# Altium schematic sheet pedala axial 03.SchDoc: Digital Guita Pedal
size A4; DrawnBy: Cenusa Mihai Marian; Engineer: Cenusa Mihai Marian; Organization: USV; Revision: v3; SheetNumber: 1; SheetTotal: 1; ProjectName: Digital Guitar Pedal
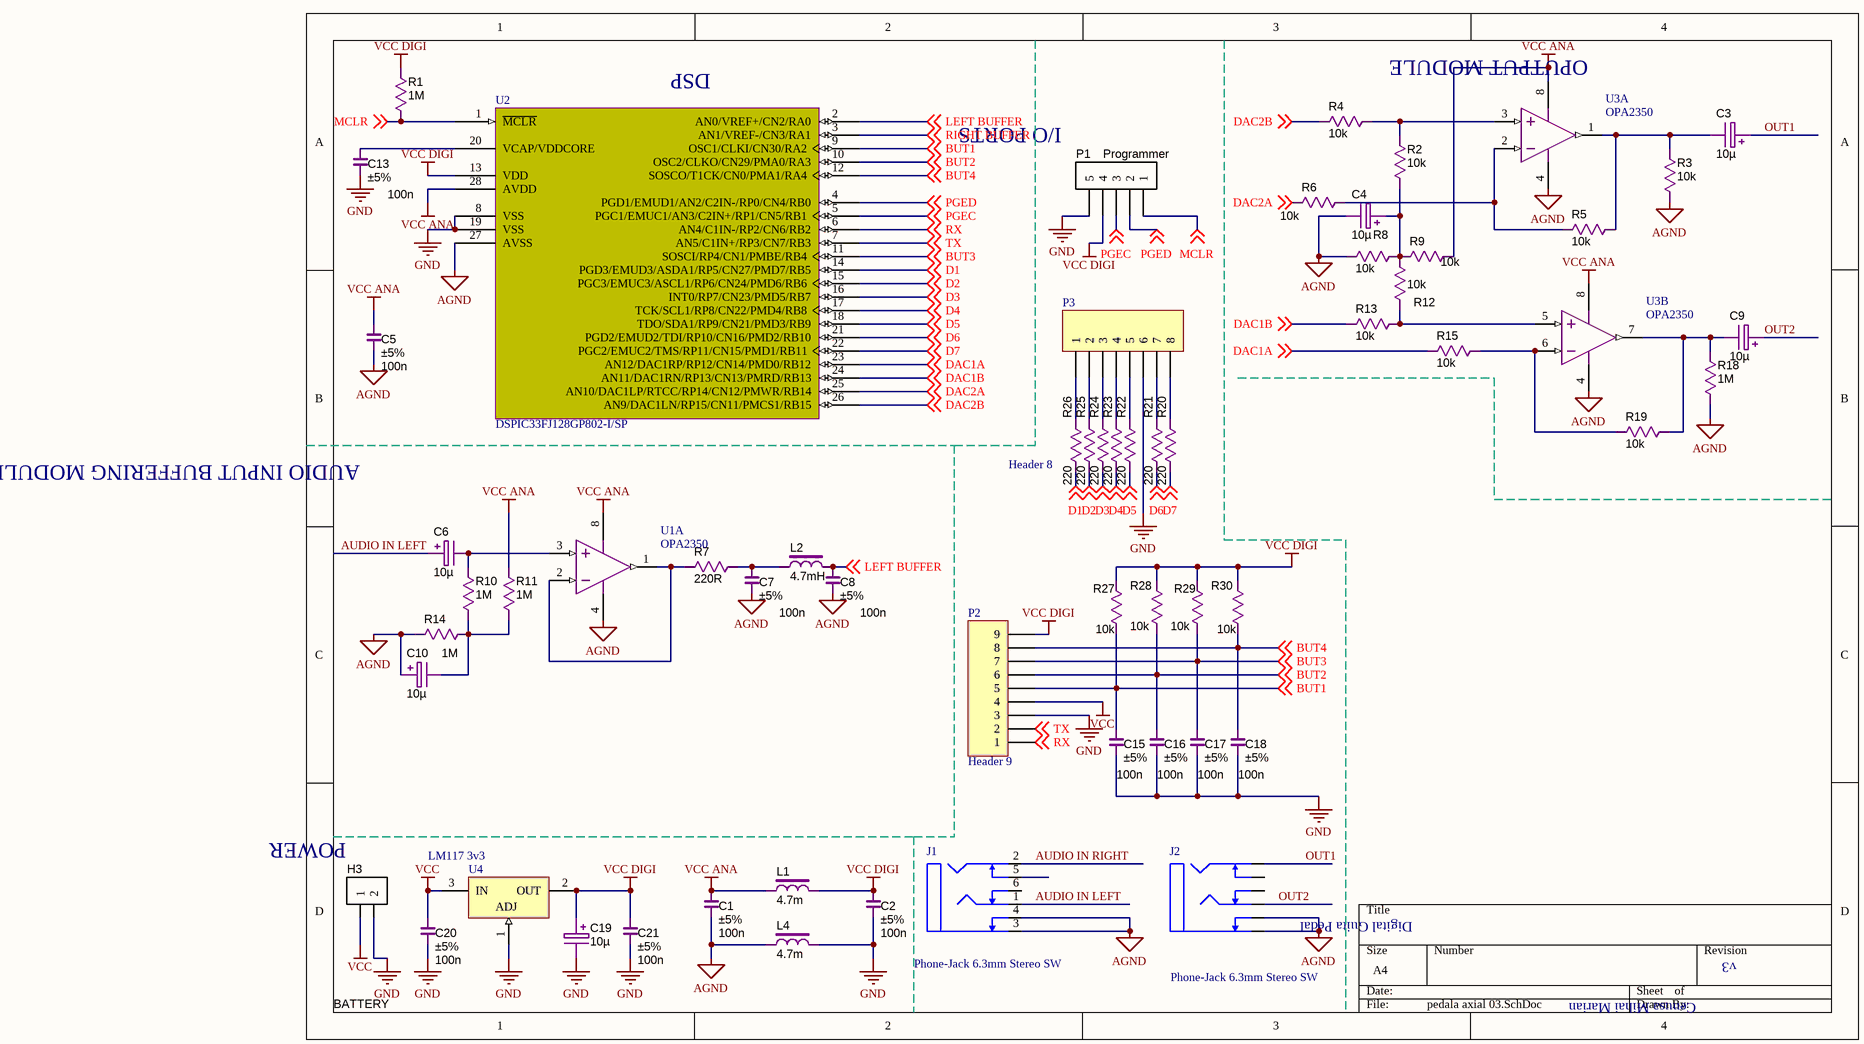
[diagram p0: pedala axial 03.SchDoc]

## Parts
C1  Tolerance: ±5%  [Cap-Disk-D5.5-R2.54]  (hidden comment: 100n)
C2  Tolerance: ±5%  [Cap-Disk-D5.5-R2.54]  (hidden comment: 100n)
C3  10µ  [CAPAE250P680X1220_VERT]
C4  10µ  [CAPAE250P680X1220_VERT]
C5  Tolerance: ±5%  [Cap-Disk-D5.5-R2.54]  (hidden comment: 100n)
C6  10µ  [CAPAE250P680X1220_VERT]
C7  Tolerance: ±5%  [Cap-Disk-D5.5-R2.54]  (hidden comment: 100n)
C8  Tolerance: ±5%  [Cap-Disk-D5.5-R2.54]  (hidden comment: 100n)
C9  10µ  [CAPAE250P680X1220_VERT]
C10  10µ  [CAPAE250P680X1220_VERT]
C13  Tolerance: ±5%  [Cap-Disk-D5.5-R2.54]  (hidden comment: 100n)
C15  Tolerance: ±5%  [Cap-Disk-D5.5-R2.54]  (hidden comment: 100n)
C16  Tolerance: ±5%  [Cap-Disk-D5.5-R2.54]  (hidden comment: 100n)
C17  Tolerance: ±5%  [Cap-Disk-D5.5-R2.54]  (hidden comment: 100n)
C18  Tolerance: ±5%  [Cap-Disk-D5.5-R2.54]  (hidden comment: 100n)
C19  10µ  [R1206-1%]
C20  Tolerance: ±5%  [Cap-Disk-D5.5-R2.54]  (hidden comment: 100n)
C21  Tolerance: ±5%  [Cap-Disk-D5.5-R2.54]  (hidden comment: 100n)
H3  BATTERY  [HDR_1X2X276]  (no BOM)
J1  Phone-Jack 6.3mm Stereo SW  [Phone-Jack Stereo SW 6.3mm]
J2  Phone-Jack 6.3mm Stereo SW  [Phone-Jack Stereo SW 6.3mm]
L1  value 4.7m  [Dr-CW8A]  (hidden comment: INDC_180u_Toroid)
L2  value 4.7mH  [Dr-CW8A]  (hidden comment: INDC_180u_Toroid)
L4  value 4.7m  [Dr-CW8A]  (hidden comment: INDC_180u_Toroid)
P1  Programmer  [HDR1X5_2.54MMP]  (no BOM)
P2  Header 9  [HDR1X9]
P3  Header 8  [HDR1X8]
R1  value 1M  [R0.25-300]  (hidden comment: Thick Film)
R2  value 10k  [R0.25-300]  (hidden comment: Thick Film)
R3  value 10k  [R0.25-300]  (hidden comment: Thick Film)
R4  value 10k  [R0.25-300]  (hidden comment: Thick Film)
R5  value 10k  [R0.25-300]  (hidden comment: Thick Film)
R6  value 10k  [R0.25-300]  (hidden comment: Thick Film)
R7  value 220R  [R0.25-300]  (hidden comment: Thick Film)
R8  value 10k  [R0.25-300]  (hidden comment: Thick Film)
R9  value 10k  [R0.25-300]  (hidden comment: Thick Film)
R10  value 1M  [R0.25-300]  (hidden comment: Thick Film)
R11  value 1M  [R0.25-300]  (hidden comment: Thick Film)
R12  value 10k  [R0.25-300]  (hidden comment: Thick Film)
R13  value 10k  [R0.25-300]  (hidden comment: Thick Film)
R14  value 1M  [R0.25-300]  (hidden comment: Thick Film)
R15  value 10k  [R0.25-300]  (hidden comment: Thick Film)
R18  value 1M  [R0.25-300]  (hidden comment: Thick Film)
R19  value 10k  [R0.25-300]  (hidden comment: Thick Film)
R20  value 220  [R0.25-300]  (hidden comment: Thick Film)
R21  value 220  [R0.25-300]  (hidden comment: Thick Film)
R22  value 220  [R0.25-300]  (hidden comment: Thick Film)
R23  value 220  [R0.25-300]  (hidden comment: Thick Film)
R24  value 220  [R0.25-300]  (hidden comment: Thick Film)
R25  value 220  [R0.25-300]  (hidden comment: Thick Film)
R26  value 220  [R0.25-300]  (hidden comment: Thick Film)
R27  value 10k  [R0.25-300]  (hidden comment: Thick Film)
R28  value 10k  [R0.25-300]  (hidden comment: Thick Film)
R29  value 10k  [R0.25-300]  (hidden comment: Thick Film)
R30  value 10k  [R0.25-300]  (hidden comment: Thick Film)
U1  OPA2350  [DIL8-300a]  (part A of 2)
U2  DSPIC33FJ128GP802-I/SP  [DIP28-300]
U3  OPA2350  [DIL8-300a]  (parts A,B of 2)
U4  LM117 3v3  [TO220-RB-650]

## Nets
AGND: C1.1 C4.2 C5.1 C7.1 C8.1 C10.1 J1.3(G) J1.4(Ga) J2.3(G) J2.4(Ga) L4.1 R3.2 R8.2 R14.2 R18.2 U1.4(V-) U2.27(AVSS) U3.4(V-)
GND: C2.1 C13.1 C15.1 C16.1 C17.1 C18.1 C19.2 C20.1 C21.1 H3.2 L4.2 P1.5 P2.3 P3.6 U2.8(VSS) U2.19(VSS) U4.1(GND)
VCC: C20.2 H3.1 P2.4 U4.3(IN)
VCC ANA: C1.2 C5.2 L1.1 R9.1 R11.1 U1.8(V+) U2.28(AVDD) U3.8(V+)
VCC DIGI: C2.2 C19.1 C21.2 L1.2 P1.4 P2.9 R1.2 R27.2 R28.2 R29.2 R30.2 U2.13(VDD) U4.2(OUT)
AUDIO IN LEFT: C6.1 J1.1(R)
AUDIO IN RIGHT: J1.2(L)
BUT1: C15.2 P2.5 R27.1 U2.9(OSC1/CLKI/CN30/RA2) ; off-sheet BUT1
BUT2: C16.2 P2.6 R28.1 U2.10(OSC2/CLKO/CN29/PMA0/RA3) ; off-sheet BUT2
BUT3: C17.2 P2.7 R29.1 U2.11(SOSCI/RP4/CN1/PMBE/RB4) ; off-sheet BUT3
BUT4: C18.2 P2.8 R30.1 U2.12(SOSCO/T1CK/CN0/PMA1/RA4) ; off-sheet BUT4
D1: R26.1 U2.14(PGD3/EMUD3/ASDA1/RP5/CN27/PMD7/RB5) ; off-sheet D1
D2: R25.1 U2.15(PGC3/EMUC3/ASCL1/RP6/CN24/PMD6/RB6) ; off-sheet D2
D3: R24.1 U2.16(INT0/RP7/CN23/PMD5/RB7) ; off-sheet D3
D4: R23.1 U2.17(TCK/SCL1/RP8/CN22/PMD4/RB8) ; off-sheet D4
D5: R22.1 U2.18(TDO/SDA1/RP9/CN21/PMD3/RB9) ; off-sheet D5
D6: R21.1 U2.21(PGD2/EMUD2/TDI/RP10/CN16/PMD2/RB10) ; off-sheet D6
D7: R20.1 U2.22(PGC2/EMUC2/TMS/RP11/CN15/PMD1/RB11) ; off-sheet D7
DAC1A: R15.1 U2.23(AN12/DAC1RP/RP12/CN14/PMD0/RB12) ; off-sheet DAC1A
DAC1B: R13.1 U2.24(AN11/DAC1RN/RP13/CN13/PMRD/RB13) ; off-sheet DAC1B
DAC2A: R6.2 U2.25(AN10/DAC1LP/RTCC/RP14/CN12/PMWR/RB14) ; off-sheet DAC2A
DAC2B: R4.2 U2.26(AN9/DAC1LN/RP15/CN11/PMCS1/RB15) ; off-sheet DAC2B
LEFT BUFFER: C8.2 L2.2 U2.2(AN0/VREF+/CN2/RA0) ; off-sheet LEFT BUFFER
MCLR: P1.1 R1.1 U2.1(~{MCLR}) ; off-sheet MCLR
OUT1: C3.1 J2.2(L)
OUT2: C9.1 J2.1(R)
PGEC: P1.3 U2.5(PGC1/EMUC1/AN3/C2IN+/RP1/CN5/RB1) ; off-sheet PGEC
PGED: P1.2 U2.4(PGD1/EMUD1/AN2/C2IN-/RP0/CN4/RB0) ; off-sheet PGED
RIGHT BUFFER: U2.3(AN1/VREF-/CN3/RA1) ; off-sheet RIGHT BUFFER
RX: P2.1 U2.6(AN4/C1IN-/RP2/CN6/RB2) ; off-sheet RX
TX: P2.2 U2.7(AN5/C1IN+/RP3/CN7/RB3) ; off-sheet TX
NetC3_2: C3.2 R3.1 R5.1 U3.1(OUT_A)
NetC4_1: C4.1 R2.1 R8.1 R9.2 R12.1
NetC6_2: C6.2 R10.1 U1.3(IN_A+)
NetC7_2: C7.2 L2.1 R7.2
NetC9_2: C9.2 R18.1 R19.1 U3.7(OUT_B)
NetC10_2: C10.2 R10.2 R11.2 R14.1
NetC13_2: C13.2 U2.20(VCAP/VDDCORE)
NetP3_1: P3.1 R26.2
NetP3_2: P3.2 R25.2
NetP3_3: P3.3 R24.2
NetP3_4: P3.4 R23.2
NetP3_5: P3.5 R22.2
NetP3_7: P3.7 R21.2
NetP3_8: P3.8 R20.2
NetR2_2: R2.2 R4.1 U3.3(IN_A+)
NetR5_2: R5.2 R6.1 U3.2(IN_A-)
NetR7_1: R7.1 U1.1(OUT_A) U1.2(IN_A-)
NetR12_2: R12.2 R13.2 U3.5(IN_B+)
NetR15_2: R15.2 R19.2 U3.6(IN_B-)

Not connected (* = marked no-connect by the designer): J1 5(La) 6(Ra); J2 5(La) 6(Ra)

## Notes on the sheet
- (near U3) OPUTPUT MODULE
- (near U2) DSP
- (near P1) I/O PORTS
- AUDIO INPUT BUFFERING MODULE
- (near H3) POWER
- (in symbol TL317CLP) ADJ

## Library data of the parts
C1 C2 C5 C7 C8 C13 C15-C18 C20 C21 = CAPC_100n_1206_NP0_50V_5%: Capacitor SMD Cer 100nF 1206 NP0 50V 5%; Manufacturer 1: TDK Corporation; Manufacturer Part Number 1: C3216C0G1H104J160AA; SCDType: undef; Ratings: 50V; NP0; Operating Temperature: -55°C ~ 125°C; Package / Case: 1206 (3216 Metric); Size / Dimension: 0.126" L x 0.063" W (3.20mm x 1.60mm); Thickness (Max): 0.075" (1.90mm); Supplier 1: Digi-Key; Supplier Part Number 1: 445-7694-1-ND; ComponentLink1URL: http://product.tdk.com/capacitor/mlcc/en/documents/mlcc_commercial_general_en.pdf; ComponentLink1Description: http://product.tdk.com/capacitor/mlcc/en/documents/mlcc_commercial_general_en.pdf; Value: 100n
C3 C4 C6 C9 C10 C19 = CAPT_330u_2917_6V3: Capacitor SMD Tant 330uF 20% 6V3 2917; Manufacturer Size Code: D; Manufacturer Part Number: T520D337M006ATE015; Ratings: 6.3V; Material: Solid Tantalum; ESR (Equivalent Series Resistance): 15 mOhm; SCDType: spec; Package / Case: 2917 (7343 Metric); Tolerance: ±20%; Operating Temperature: -55°C ~ 125°C; Size / Dimension: 0.287" L x 0.169" W (7.30mm x 4.30mm); Height - Seated (Max): 0.122" (3.10mm); Supplier 1: Digi-Key; Supplier Part Number 1: 399-4052-1-ND; ComponentLink1URL: http://www.kemet.com/datasheets&T520D337M006ATE015; ComponentLink1Description: T520D Datasheet; Value: 10µ
H3 = Header2P: Header, 2-pin
L1 L2 L4 = INDC_180u_Toroid: Power Inductor 180µH 10% SMD Toroid; Manufacturer 1: JW Miller A Bourns Company; Manufacturer Part Number 1: PM2110-181K-RC; Ratings: 3.7A; SCDType: spec; Package / Case: 1.200" L x 1.000" W x 0.530" H; Tolerance: ±10%; Supplier 1: Digi-Key; Supplier Part Number 1: M8769-ND; Current: 3.7A
P1 = Header5P: Header 5-pin
P2 = Header 9: Header, 9-Pin; LatestRevisionDate: 17-Jul-2002; LatestRevisionNote: Re-released for DXP Platform.; Publisher: Altium Limited
P3 = Header 8: Header, 8-Pin; LatestRevisionDate: 17-Jul-2002; LatestRevisionNote: Re-released for DXP Platform.; Publisher: Altium Limited
R1-R15 R18-R30 = RES_1M_0805_5%: Resistor SMD chip 1M Ohm 0.125W 5% 0805; Manufacturer 1: Vishay/Dale; Manufacturer Part Number 1: CRCW08051M00JNEA; Ratings: 1/8W; SCDType: spec; Tolerance: ±5%; Package / Case: 0805 (2012 metric); Supplier 1: Digi-Key; Supplier Part Number 1: 541-1.0MACT-ND
U1 U3 = OPA2313ID: 1-MHz, Micropower, Low-Noise, Rail-to-Rail I/O Operational Amplifier, 1.8 to 5.5 V, -40 to 125 degC, 8-pin SOIC (D8), Green (RoHS & no Sb/Br); Manufacturer: Texas Instruments; CMRR(Min)(dB): 70; GBW(Typ)(MHz): 1; Iq per channel(Max)(mA): 0.06; Number of Channels: 2; Packing: TUBE; Rating: Catalog; Slew Rate(Typ)(V/us): 0.5; SubFamily: Low Input Bias Current Amp (<=10pA), Low Power Amp (<=500uA); Total Supply Voltage(Max)(+5V is 5, +/-5V is 10): 5.5; Total Supply Voltage(Min)(+5V is 5, +/-5V is 10): 1.8; Vio (25C)(Max)(mV): 2.5; DatasheetVersion: SBOS649C; PackageVersion: 4040047-3/M, 06/2011; PackageReference: D8; PackageDescription: 8-Pin Plastic Small Outline, Body 4.9 x 3.9 mm, Pitch 1.27 mm; Supplier 1: Digi-Key; Supplier Part Number 1: 296-35005-ND; Supplier 2: Newark; Supplier Part Number 2: 47W7351; Supplier 3: Mouser; Supplier Part Number 3: 595-OPA2313ID; Eco-Plan: Green (RoHS & no Sb/Br); Offset Drift(Typ)(uV/C): 2; Mounting Technology: Surface Mount; Code_JEDEC: MS-012; PartNumber: OPA2313ID; ComponentLink1Description: Manufacturer URL; ComponentLink1URL: http://www.ti.com/; ComponentLink2Description: Datasheet; ComponentLink2URL: http://www.ti.com/lit/ds/symlink/opa2313.pdf; ComponentLink3Description: Package Specification; ComponentLink3URL: http://www.ti.com/litv/pdf/msoi002j
U2 = DSPIC33FJ128GP802-I/SP: High-Performance 16-bit Digital Signal Controller, 128 KB Flash, 16 KB RAM, 28-Pin SPDIP, Industrial Temperature; Manufacturer: Microchip; DatasheetVersion: revD, Nov-2009; PackageVersion: revBB, Aug-2009; PackageReference: SPDIP300-SP28; PackageDescription: 28-Lead Skinny Plastic Dual In-Line (SP) - 300 mil Body [SPDIP]; Supplier 1: Digi-Key; Supplier Part Number 1: DSPIC33FJ128GP802-I/SP-ND; Supplier 2: Farnell; Supplier Part Number 2: 1576801; Supplier 3: Newark; Supplier Part Number 3: 39M8119; Supplier 4: Mouser; Supplier Part Number 4: 579-DSPIC128GP802ISP; Mounting Technology: Through Hole; PartNumber: DSPIC33FJ128GP802-I/SP; ComponentLink1Description: Manufacturer URL; ComponentLink1URL: http://www.microchip.com/; ComponentLink2Description: Datasheet; ComponentLink2URL: http://ww1.microchip.com/downloads/en/DeviceDoc/70292D.pdf; ComponentLink3Description: Package Specification; ComponentLink3URL: http://www.microchip.com/stellent/groups/techpub_sg/documents/packagingspec/en012702.pdf
U4 = TL317CLP: Adjustable Regulator with 5 to 38 V Input and 1.2 to 32 V Output, 0 to 125 degC, 3-Pin TO-92 (LP), Pb-Free (RoHS); Manufacturer: Texas Instruments; Iout(Max)(A): 0.1; SubFamily: Single Channel LDO; Vin(Max)(V): 38; Vin(Min)(V): 5; Vout(Max)(V): 32; Vout(Min)(V): 1.2; DatasheetVersion: SLVS004H; PackageVersion: revC, Oct-2001; PackageReference: LP3; PackageDescription: Plastic Cylindrical Package, Formed Lead Option (TO-92); Supplier 1: Digi-Key; Supplier Part Number 1: 296-10167-5-ND; Supplier 2: Farnell; Supplier Part Number 2: 9593519; Supplier 3: Newark; Supplier Part Number 3: 08F9402; Supplier 4: Mouser; Supplier Part Number 4: 595-TL317CLP; Eco-Plan: Pb-Free (RoHS); Mounting Technology: Through Hole; Code_JEDEC: TO-226-AA; PartNumber: TL317CLP; ComponentLink1Description: Datasheet; ComponentLink1URL: http://www.ti.com/general/docs/lit/getliterature.tsp?genericPartNumber=TL317&fileType=pdf; ComponentLink2Description: Package Specification; ComponentLink2URL: http://www.ti.com/litv/pdf/msot002a; ComponentLink3Description: URL Link1; ComponentLink3URL: Samples URL:http://www.ti.com/product/tl317#samples